# Altium schematic sheet SAMV71_Xplained_Ultra_EDBG.SchDoc: Embedded Debugger (EDBG)
size A3; Organization: Microchip Norway; Address1: Vestre Rosten 79; Address2: N-7075 TILLER; Address3: NORWAY; DocumentNumber: A09-2407; Revision: 12; SheetNumber: 13; SheetTotal: 13; DrawnBy: Microchip Norway; Engineer: AH; PageSetup: Record=PageOptions|CenterHorizontal=True|CenterVertical=True|PrintScale=0.73|XCorrection=1.00|YCorrection=1.00|PrintKind=1|BorderSize=5000000|LeftOffset=0|BottomOffset=0|Orientation=2|PaperLength=1000|PaperWidth=1000|Scale=100|PaperSource=7|PrintQuality=-4|MediaType=1|DitherType=10|PaperKind=A3 (297 x 420 mm)|PrintScaleMode=1; ProjectTitle: SAM V71 Xplained Ultra; PCBNumber: A08-2216; PCBRevision: 4
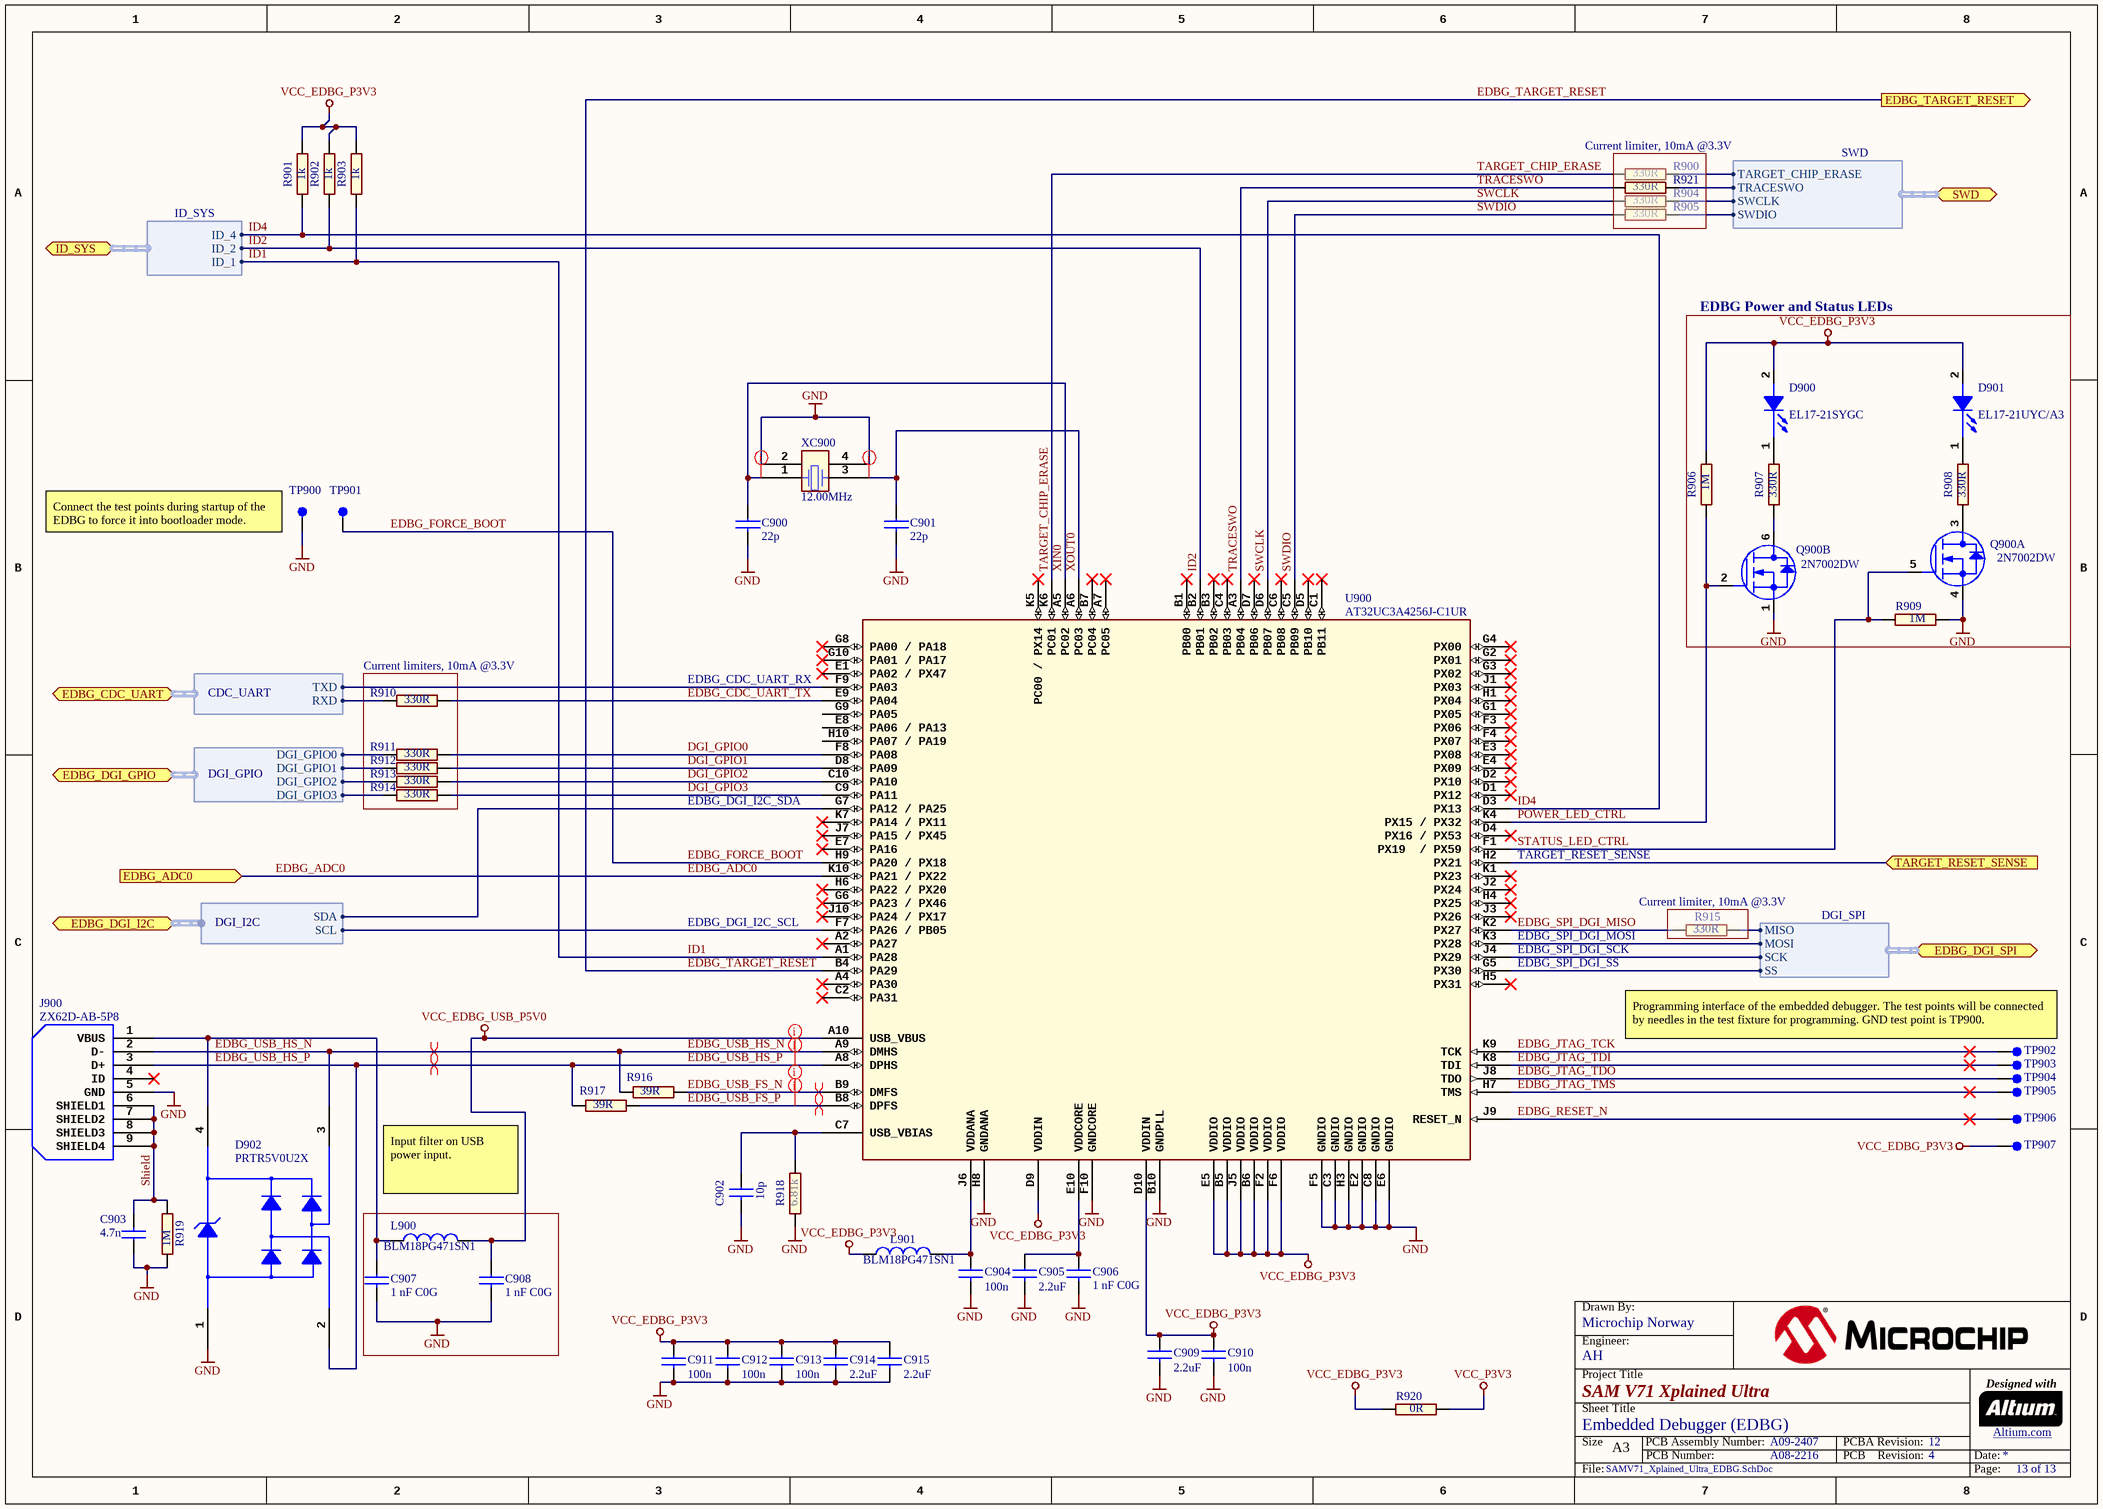
[diagram p0: SAMV71_Xplained_Ultra_EDBG.SchDoc]

## Parts
C900  value 22p  [AP1-00053]
C901  value 22p  [AP1-00053]
C902  value 10p  [AP1-00053]
C903  value 4.7n  [AP1-00053]
C904  value 100n  [AP1-00053]
C905  value 2.2uF  [AP1-00053]  (hidden comment: Farnell no: 1288200)
C906  value 1 nF C0G  [AP1-00053]
C907  value 1 nF C0G  [AP1-00053]
C908  value 1 nF C0G  [AP1-00053]
C909  value 2.2uF  [AP1-00053]  (hidden comment: Farnell no: 1288200)
C910  value 100n  [AP1-00053]
C911  value 100n  [AP1-00053]
C912  value 100n  [AP1-00053]
C913  value 100n  [AP1-00053]
C914  value 2.2uF  [AP1-00053]  (hidden comment: Farnell no: 1288200)
C915  value 2.2uF  [AP1-00053]  (hidden comment: Farnell no: 1288200)
D900  value EL17-21SYGC  [AP4-00013]
D901  value EL17-21UYC/A3  [AP4-00013]
D902  value PRTR5V0U2X  [AP4-00001]
J900  value ZX62D-AB-5P8  [AP8-00852]  (hidden comment: 2,000 pieces per reel)
L900  value BLM18PG471SN1  [AP3-00005]
L901  value BLM18PG471SN1  [AP3-00005]
Q900  value 2N7002DW  [AP5-00001]  (hidden comment: Same as 2N7002 but with two MOSFETs in one package)  (parts A,B of 2)
R900  value 330R  [AP2-00000]
R901  value 1k  [AP2-00000]
R902  value 1k  [AP2-00000]
R903  value 1k  [AP2-00000]
R904  value 330R  [AP2-00000]
R905  value 330R  [AP2-00000]
R906  value 1M  [AP2-00000]
R907  value 330R  [AP2-00000]
R908  value 330R  [AP2-00000]
R909  value 1M  [AP2-00000]
R910  value 330R  [AP2-00000]
R911  value 330R  [AP2-00000]
R912  value 330R  [AP2-00000]
R913  value 330R  [AP2-00000]
R914  value 330R  [AP2-00000]
R915  value 330R  [AP2-00000]
R916  value 39R  [AP2-00011]
R917  value 39R  [AP2-00011]
R918  value 6.81k  [AP2-00011]
R919  value 1M  [AP2-00011]
R920  value 0R  [AP2-00000]
R921  value 330R  [AP2-00000]
TP900  (no value)  [AP8-00010]  (no BOM)
TP901  (no value)  [AP8-00010]  (no BOM)
TP902  (no value)  [AP8-00010]  (no BOM)
TP903  (no value)  [AP8-00010]  (no BOM)
TP904  (no value)  [AP8-00010]  (no BOM)
TP905  (no value)  [AP8-00010]  (no BOM)
TP906  (no value)  [AP8-00010]  (no BOM)
TP907  (no value)  [AP8-00010]  (no BOM)
U900  value AT32UC3A4256J-C1UR  [AP6-00206]  (hidden comment: 100 ball VFBGA)
XC900  value 12.00MHz  [AP7-00039]

## Blocks framed on the sheet
EDBG Power and Status LEDs: D900 D901 Q900 R906-R909
Current limiters, 10mA @3.3V: R910-R914

## Ports
EDBG_ADC0 (in), EDBG_CDC_UART (harness CDC_UART), EDBG_DGI_GPIO (harness DGI_GPIO), EDBG_DGI_I2C (harness DGI_I2C), EDBG_DGI_SPI (harness DGI_SPI), EDBG_TARGET_RESET (out), ID_SYS (harness ID_SYS), SWD (harness SWD), TARGET_RESET_SENSE (in)

## Harnesses
CDC_UART: TXD, RXD
DGI_SPI: MISO, MOSI, SCK, SS
DGI_GPIO: DGI_GPIO0, DGI_GPIO1, DGI_GPIO2, DGI_GPIO3
ID_SYS: ID_1, ID_2, ID_4
SWD: SWCLK, SWDIO, TARGET_CHIP_ERASE, TRACESWO
DGI_I2C: SCL, SDA

## Nets
GND: C900.2 C901.2 C902.2 C903.1 C904.2 C905.2 C906.2 C907.2 C908.2 C909.2 C910.2 C911.2 C912.2 C913.2 C914.2 C915.2 D902.1(GND) J900.5(GND) Q900.1(S2) Q900.4(S1) R909.1 R918.1 R919.1 TP900.1 U900.B10(GNDPLL) U900.C3(GNDIO) U900.C8(GNDIO) U900.E2(GNDIO) U900.E6(GNDIO) U900.F5(GNDIO) U900.F10(GNDCORE) U900.H3(GNDIO) U900.H8(GNDANA) XC900.2 XC900.4
VCC_EDBG_P3V3: C909.1 C910.1 C911.1 C912.1 C913.1 C914.1 C915.1 D900.2(ANODE) D901.2(ANODE) L901.1 R901.2 R902.2 R903.2 R906.2 R920.1 TP907.1 U900.B5(VDDIO) U900.B6(VDDIO) U900.D9(VDDIN) U900.D10(VDDIN) U900.E5(VDDIO) U900.F2(VDDIO) U900.F6(VDDIO) U900.J5(VDDIO)
VCC_EDBG_USB_P5V0: C908.1 L900.2 U900.A10(USB_VBUS)
VCC_P3V3: R920.2
DGI_GPIO0: R911.2 U900.F8(PA08)
DGI_GPIO1: R912.2 U900.D8(PA09)
DGI_GPIO2: R913.2 U900.C10(PA10)
DGI_GPIO3: R914.2 U900.C9(PA11)
EDBG_ADC0: U900.K10(PA21_/_PX22) ; port EDBG_ADC0
EDBG_CDC_UART_TX: R910.2 U900.E9(PA04)
EDBG_FORCE_BOOT: TP901.1 U900.H9(PA20_/_PX18)
EDBG_JTAG_TCK: TP902.1 U900.K9(TCK)
EDBG_JTAG_TDI: TP903.1 U900.K8(TDI)
EDBG_JTAG_TDO: TP904.1 U900.J8(TDO)
EDBG_JTAG_TMS: TP905.1 U900.H7(TMS)
EDBG_RESET_N: TP906.1 U900.J9(RESET_N)
EDBG_SPI_DGI_MISO: R915.1 U900.K2(PX27)
EDBG_TARGET_RESET: U900.B4(PA29) ; port EDBG_TARGET_RESET
EDBG_USB_FS_N: R916.2 U900.B9(DMFS)
EDBG_USB_FS_P: R917.2 U900.B8(DPFS)
EDBG_USB_HS_N: D902.3(I/O_2) J900.2(D-) R916.1 U900.A9(DMHS)
EDBG_USB_HS_P: D902.2(I/O_1) J900.3(D+) R917.1 U900.A8(DPHS)
ID1: R903.1 U900.A1(PA28) ; port ID_SYS.ID_1
ID2: R902.1 U900.B2(PB01) ; port ID_SYS.ID_2
ID4: R901.1 U900.D3(PX13) ; port ID_SYS.ID_4
POWER_LED_CTRL: Q900.2(G2) R906.1 U900.K4(PX15_/_PX32)
Shield: C903.2 J900.6(SHIELD1) J900.7(SHIELD2) J900.8(SHIELD3) J900.9(SHIELD4) R919.2
STATUS_LED_CTRL: Q900.5(G1) R909.2 U900.F1(PX19__/_PX59)
SWCLK: R904.1 U900.D6(PB07)
SWDIO: R905.1 U900.C5(PB09)
TARGET_CHIP_ERASE: R900.1 U900.K6(PC01)
TARGET_RESET_SENSE: U900.H2(PX21) ; port TARGET_RESET_SENSE
TRACESWO: R921.1 U900.A3(PB04)
XIN0: C900.1 U900.A5(PC02) XC900.1
XOUT0: C901.1 U900.A6(PC03) XC900.3
NetC902_1: C902.1 R918.2 U900.C7(USB_VBIAS)
NetC904_1: C904.1 L901.2 U900.J6(VDDANA)
NetC905_1: C905.1 C906.1 U900.E10(VDDCORE)
NetC907_1: C907.1 D902.4(VCC) J900.1(VBUS) L900.1
NetD900_1: D900.1(CATHODE) R907.2
NetD901_1: D901.1(CATHODE) R908.2
NetQ900_3: Q900.3(D1) R908.1
NetQ900_6: Q900.6(D2) R907.1
NetR900_2: R900.2 ; port SWD.TARGET_CHIP_ERASE
NetR904_2: R904.2 ; port SWD.SWCLK
NetR905_2: R905.2 ; port SWD.SWDIO
NetR910_1: R910.1 ; port EDBG_CDC_UART.RXD
NetR911_1: R911.1 ; port EDBG_DGI_GPIO.DGI_GPIO0
NetR912_1: R912.1 ; port EDBG_DGI_GPIO.DGI_GPIO1
NetR913_1: R913.1 ; port EDBG_DGI_GPIO.DGI_GPIO2
NetR914_1: R914.1 ; port EDBG_DGI_GPIO.DGI_GPIO3
NetR915_2: R915.2 ; port EDBG_DGI_SPI.MISO
NetR921_2: R921.2 ; port SWD.TRACESWO
NetU900_F7: U900.F7(PA26_/_PB05) ; port EDBG_DGI_I2C.SCL
NetU900_F9: U900.F9(PA03) ; port EDBG_CDC_UART.TXD
NetU900_G5: U900.G5(PX30) ; port EDBG_DGI_SPI.SS
NetU900_G7: U900.G7(PA12_/_PA25) ; port EDBG_DGI_I2C.SDA
NetU900_J4: U900.J4(PX29) ; port EDBG_DGI_SPI.SCK
NetU900_K3: U900.K3(PX28) ; port EDBG_DGI_SPI.MOSI

Not connected (* = marked no-connect by the designer): J900 4(ID)*; U900 A2(PA27)* A4(PA30)* A7(PC05)* B1(PB00)* B3(PB02)* B7(PC04)* C1(PB11)* C2(PA31)* C4(PB03)* C6(PB08)* D1(PX12)* D2(PX10)* D4(PX16_/_PX53)* D5(PB10)* D7(PB06)* E1(PA02_/_PX47)* E3(PX08)* E4(PX09)* E7(PA16)* E8(PA06_/_PA13) F3(PX06)* F4(PX07)* G1(PX05)* G2(PX01)* G3(PX02)* G4(PX00)* G6(PA23_/_PX46)* G8(PA00_/_PA18)* G9(PA05) G10(PA01_/_PA17)* H1(PX04)* H4(PX25)* H5(PX31)* H6(PA22_/_PX20)* H10(PA07_/_PA19) J1(PX03)* J2(PX24)* J3(PX26)* J7(PA15_/_PX45)* J10(PA24_/_PX17)* K1(PX23)* K5(PC00_/_PX14)* K7(PA14_/_PX11)*

## Layout directives
differential pair: EDBG_USB_FS_N, EDBG_USB_FS_P, EDBG_USB_HS_N, EDBG_USB_HS_P
rule Assembly Testpoint Usage [Testpoint - Not Allowed    Multiple - Not Allowed]; rule Fabrication Testpoint Usage [Testpoint - Not Allowed    Multiple - Not Allowed]: EDBG_USB_FS_N, EDBG_USB_FS_P, EDBG_USB_HS_N, EDBG_USB_HS_P, XIN0, XOUT0

## Notes on the sheet
- Current limiter, 10mA @3.3V
- (near TP900) Connect the test points during startup of the EDBG to force it into bootloader mode.
- EDBG_CDC_UART_RX
- EDBG_DGI_I2C_SDA
- (near U900) TARGET_RESET_SENSE
- (near R915) Current limiter, 10mA @3.3V
- EDBG_DGI_I2C_SCL
- EDBG_SPI_DGI_MOSI
- EDBG_SPI_DGI_SCK
- (near U900) EDBG_SPI_DGI_SS
- (near TP902) Programming interface of the embedded debugger. The test points will be connected by needles in the test fixture for programming. GND test point is TP900.
- Input filter on USB power input.
- Drawn By:
- Project Title
- Engineer:
- Designed with
- Sheet Title
- Size
- A3
- PCB Number:
- PCB Assembly Number:
- PCBA Revision:
- PCB    Revision:
- Date:
- Altium.com <http://go.altium.com/MicrochipLandingPage_Evaluation.html>
- File:
- Page:

## Library data of the parts
C900 C901 = A01-0019: Ceramic capacitor, SMD 0402, NP0, 50V, +/-5%; PartGroup: Capacitors,Ceramic,SMD 0402; Manufacturer: YAGEO CORP; MPN: CC0402JRNPO9BN220; TemperatureRange: -55 - +125 deg C; AN: A01-0019; Tolerance: 50V, +/-5%; Height: 0,550000011920929
C902 = A01-0015: Ceramic capacitor, SMD 0402, NP0, 50V, +/-5%; PartGroup: Capacitors,Ceramic,SMD 0402; Manufacturer: AVX; MPN: 04025A100JAT2A; TemperatureRange: -55 - +125 deg C; AN: A01-0015; Tolerance: 50V, +/-5%; Height: 0,550000011920929
C903 = A01-0046: Ceramic capacitor, SMD 0402, X7R, 25V, +/-10%; PartGroup: Capacitors,Ceramic,SMD 0402; Manufacturer: PHYCOMP; MPN: 2238 587 15632; TemperatureRange: -55 - +125 deg C; AN: A01-0046; Tolerance: 25V, +/-10%; Height: 0,550000011920929
C904 C910-C913 = A01-0246: Ceramic capacitor, SMD 0402, X7R, 16V, +/-10%; PartGroup: Capacitors,Ceramic,SMD 0402; Manufacturer: Kemet; MPN: C0402C104K4RACTU; TemperatureRange: -55 - +125 deg C; AN: A01-0246; Tolerance: 16V, +/-10%; Height: 0,5
C905 C909 C914 C915 = A01-0300: Ceramic capacitor, SMD 0402, X5R, 6.3V, +/-20%; PartGroup: Capacitors,Ceramic,SMD 0402; Manufacturer: Kemet; MPN: C0402C225M9PAC; Tolerance: Â±20%; TemperatureRange: -55Â°C to +85Â°C; AN: A01-0300; Height: 0,5
C906-C908 = A01-0321: Ceramic capacitor, SMD 0402, C0G, 50V, +/-5%; PartGroup: Capacitors,Ceramic,SMD 0402; Manufacturer: Murata; MPN: GRM1555C1H102JA01D; Tolerance: 5%; AN: A01-0321; Height: 0,550000011920929
D900 = A10-0018: LED, Green, Wave length=575nm, SMD 0805, ±70°; PartGroup: Opto,LEDs,SMD; Manufacturer: Everlight; TemperatureRange: -40 - +85 deg C; AN: A10-0018; Height: 1,10000002384186; MPN: EL17-21SYGC
D901 = A10-0019: LED, Yellow, Wave length=591nm, SMD 0805, ±70°; PartGroup: Opto,LEDs,SMD; Manufacturer: Everlight; MPN: 17-21UYC/S530-A3/TR8; TemperatureRange: -40 to +85 deg C; AN: A10-0019; Height: 1,10000002384186
D902 = A06-0236: Double rail-to-rail USB ESD protection diode; Manufacturer: NXP; PartGroup: Integrated Circuits,Special function,Protection; TemperatureRange: -40 to +85 C; AN: A06-0236; PartType: Buy; Height: 1,10000002384186; MPN: PRTR5V0U2X
J900 = A08-2112: Micro USB AB Connector, Standard SMT + DIP; PartGroup: Mechanical devices,Connectors,USB; Manufacturer: HIROSE; MPN: ZX62D-AB-5P8(30); AN: A08-2112; Height: 2,79999995231628
L900 L901 = A03-0035: SMD RF inductor 0603. Z=470Ohm (@100MHz), Max R(dc)=0.65Ohm, Max current=1A; PartGroup: Inductors,EMI; Manufacturer: Murata; TemperatureRange: -55; AN: A03-0035; Height: 0,800000011920929; MPN: BLM18PG471SN1
Q900 = A05-0051: Dual N-Channel MOSFET, 60V, 115mA cont,RDS(ON) < 7.5 Ohm @50mA@5V, SOT-363; PartGroup: Transistors,Small signal FET,SMD; Manufacturer: Fairchild; TemperatureRange: -65 to 150 deg C; AN: A05-0051; Height: 1,10000002384186; MPN: 2N7002DW
R900 R904 R905 R907 R908 R910-R915 R921 = A02-0200: Thick film resistor, SMD 0402, 1/16W, 1%; PartGroup: Resistors,SMD,0402 1%; Manufacturer: ASJ; MPN: CR10-3300-FK; TemperatureRange: -55 - +125 deg C; AN: A02-0200; Tolerance: 1 %; Height: 0,349999994039536
R901-R903 = A02-0212: Thick film resistor, SMD 0402, 1/16W, 1%; PartGroup: Resistors,SMD,0402 1%; Manufacturer: ASJ; MPN: CR10-1001-FK; TemperatureRange: -55 - +125 deg C; AN: A02-0212; Tolerance: 1 %; Height: 0,349999994039536
R906 R909 R919 = A02-0284: Thick film resistor, SMD 0402, 1/16W, 1%; PartGroup: Resistors,SMD,0402 1%; Manufacturer: ASJ; MPN: CR10-1004-FK; TemperatureRange: -55 - +125 deg C; AN: A02-0284; Tolerance: 1 %; Height: 0,349999994039536
R916 R917 = A02-0178: Thick film resistor, SMD 0402, 1/16W, 1%; PartGroup: Resistors,SMD,0402 1%; Manufacturer: ASJ; MPN: CR10-39R0-FK; TemperatureRange: -55 - +125 deg C; AN: A02-0178; Tolerance: 1 %; Height: 0,349999994039536
R918 = A02-0539: Thick film resistor, SMD 0402, 1/16W, 1%; PartGroup: Resistors,SMD,0402 1%; Manufacturer: vishay; MPN: CRCW04026K81FKED; TemperatureRange: -55 - +125 deg C; AN: A02-0539; Tolerance: 1%; Height: 0,349999994039536
R920 = A02-0163: Thick film resistor, SMD 0402, 1/16W, 1%; PartGroup: Resistors,SMD,0402 1%; Manufacturer: (n/a); MPN: RMCF0402ZT0R00; TemperatureRange: -55 - +125 deg C; AN: A02-0163; Tolerance: 1 %; Height: 0,349999994039536
TP900-TP907 = A08-0004: Single SMD testpad; PartGroup: Mechanical devices,Connectors,Test points; AN: A08-0004; Height: 0; Value: TESTPAD
U900 = A06-0736: AVR 32-bit RISC MCU; PartGroup: Integrated Circuits,MCU, MPU, DSP,AVR MCU; Manufacturer: ATMEL; TemperatureRange: -40 to +85 deg C; AN: A06-0736; Height: 1; MPN: AT32UC3A4256J-C1UR
XC900 = A07-0042: Fox FQ5032B 12.0MHz SMD crystal 738B-12; PartGroup: Frequency devices,Crystals,SMD; Manufacturer: Fox  Electronics; MPN: FQ5032B-12.000; Tolerance: Â±30ppm; TemperatureRange: 0Â°C ~ 70Â°C; AN: A07-0042; Height: 1,20000004768372